# EAGLE design shrew-rx (EAGLE 7.6.0)
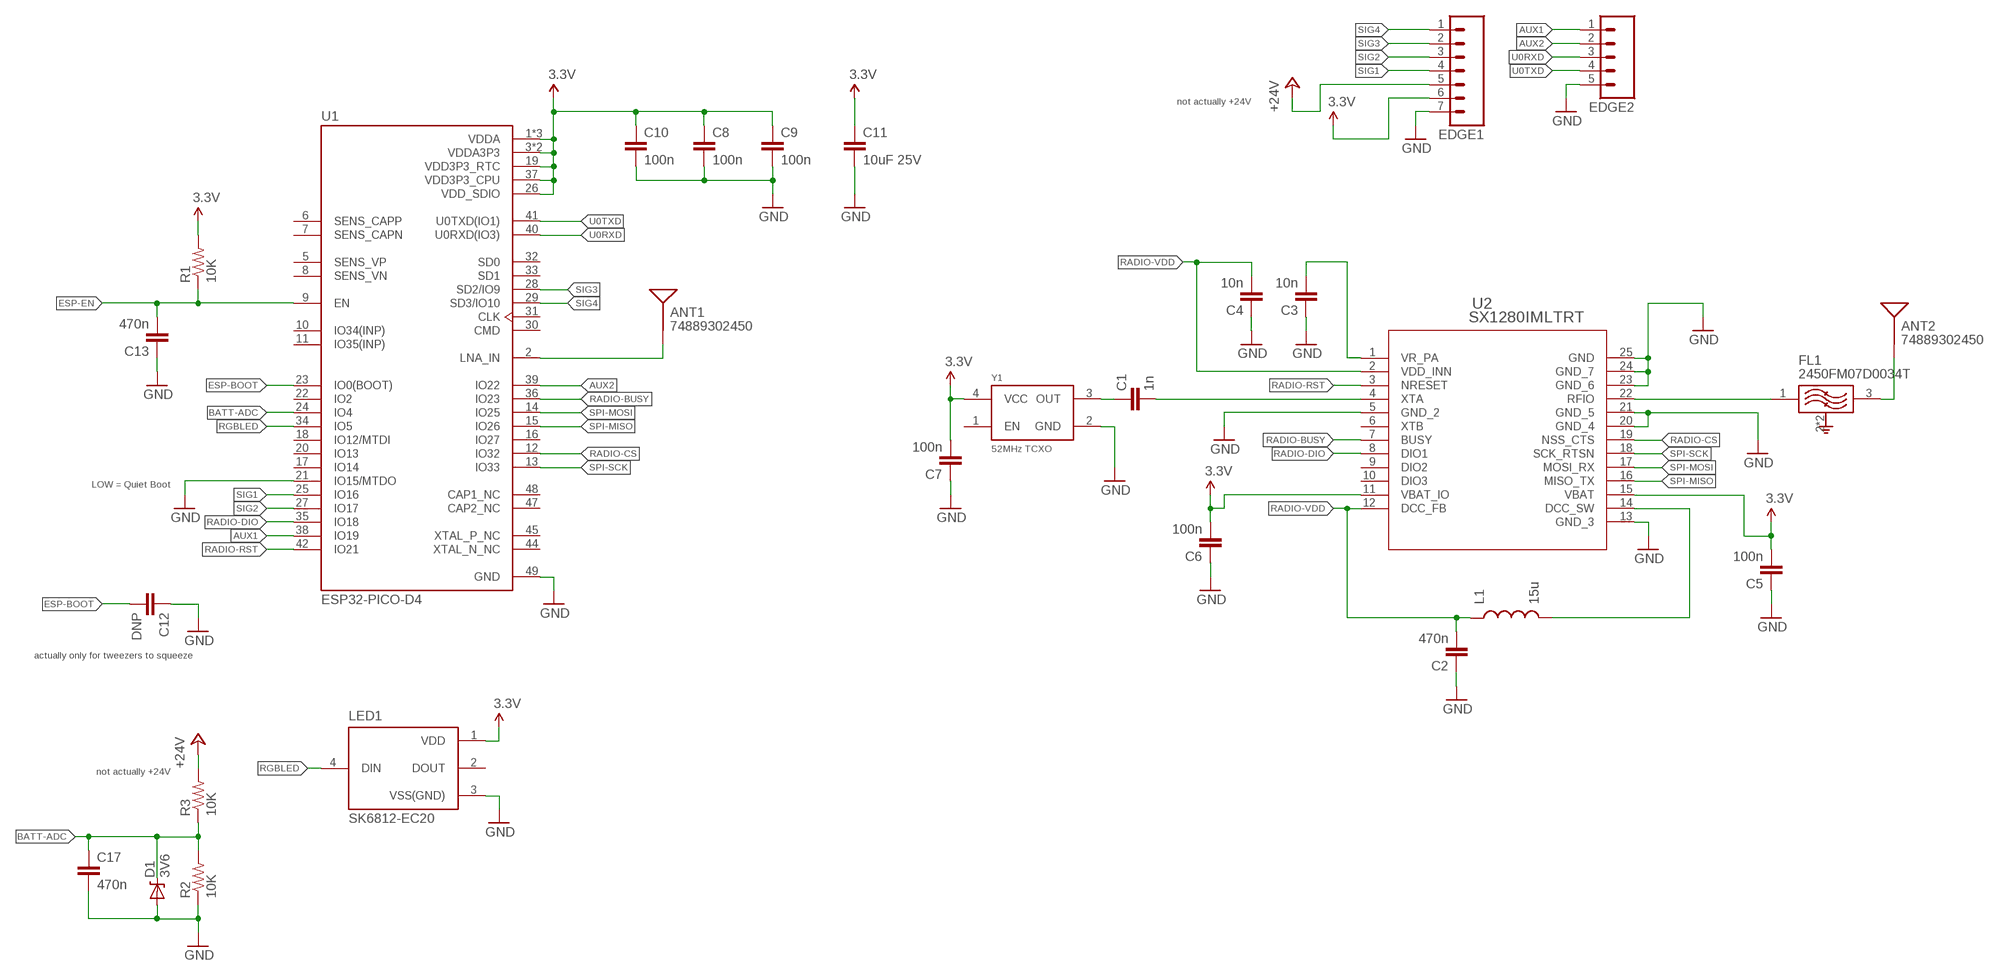
[diagram p0: schematic, sheet 1]

## Parts
ANT1  74889302450  ANTENNA2SMD  [ANTENNA-CHIP2]
ANT2  74889302450  ANTENNA2SMD  [ANTENNA-CHIP2]
C1  1n  CAP0402-REV  [0402-REV]
C2  470n  CAP0402-REV  [0402-REV]
C3  10n  CAP0402-REV  [0402-REV]
C4  10n  CAP0402-REV  [0402-REV]
C5  100n  CAP0402-REV  [0402-REV]
C6  100n  CAP0402-REV  [0402-REV]
C7  100n  CAP0402-REV  [0402-REV]
C8  100n  CAP0402-REV  [0402-REV]
C9  100n  CAP0402-REV  [0402-REV]
C10  100n  CAP0402-REV  [0402-REV]
C11  10uF 25V  CAP0805  [0805]
C12  DNP  CAP0402-CAP  [0402-CAP]
C13  470n  CAP0402-REV  [0402-REV]
C17  470n  CAP0402-REV  [0402-REV]
D1  3V6  DIODE-ZENER-BZT52  [SOD-323]
EDGE1  M07-2MM-TH  [1X07-2MM-TH]
EDGE2  M05PTH  [1X05]
FL1  2450FM07D0034T  [FIL_2450FM07D0034T]
L1  15u  INDUCTOR0805  [0805]
LED1  SK6812-EC20  [SK6812-EC20]
R1  10K  RESISTOR0402-REV  [0402-REV]
R2  10K  RESISTOR0402-REV  [0402-REV]
R3  10K  RESISTOR0402-REV  [0402-REV]
U1  ESP32-PICO-D4  [PQFN50P700X700X104-49N]
U2  SX1280IMLTRT  [QFN24_4X4_SEM]
Y1  52MHz TCXO  OSCILLATOR-TG2016SMN  [OSC_TG2016SMN_50.0000M-ECGNNMB]

## Nets
3.3V: C5.2 C6.2 C7.2 C8.1 C9.1 C10.1 C11.1 EDGE1.6 LED1.1(VDD) R1.2 U1.1(VDDA) U1.3(VDDA3P3) U1.4(VDDA3P3) U1.19(VDD3P3_RTC) U1.26(VDD_SDIO) U1.37(VDD3P3_CPU) U1.43(VDDA) U1.46(VDDA) U2.11(VBAT_IO) U2.15(VBAT) Y1.4(VCC)
AUX1: EDGE2.1 U1.38(IO19)
AUX2: EDGE2.2 U1.39(IO22)
BATT-ADC: C17.1 D1.1(C) R2.2 R3.1 U1.24(IO4)
ESP-BOOT: C12.2 U1.23(IO0(BOOT))
ESP-EN: C13.2 R1.1 U1.9(EN)
GND: C2.1 C3.1 C4.1 C5.1 C6.1 C7.1 C8.2 C9.2 C10.2 C11.2 C12.1 C13.1 C17.2 D1.2(A) EDGE1.7 EDGE2.5 LED1.3(VSS(GND)) R2.1 U1.21(IO15/MTDO) U1.49(GND) U2.5(GND_2) U2.13(GND_3) U2.20(GND_4) U2.21(GND_5) U2.23(GND_6) U2.24(GND_7) U2.25(GND) Y1.2(GND)
N$1: ANT1.FEED(SIGNAL) U1.2(LNA_IN)
N$2: C1.1 Y1.3(OUT)
N$3: C1.2 U2.4(XTA)
N$6: FL1.1(IN) U2.22(RFIO)
N$7: ANT2.FEED(SIGNAL) FL1.3(OUT)
N$9: L1.2 U2.14(DCC_SW)
N$11: C3.2 U2.1(VR_PA)
RADIO-BUSY: U1.36(IO23) U2.7(BUSY)
RADIO-CS: U1.12(IO32) U2.19(NSS_CTS)
RADIO-DIO: U1.35(IO18) U2.8(DIO1)
RADIO-RST: U1.42(IO21) U2.3(NRESET)
RADIO-VDD: C2.2 C4.2 L1.1 U2.2(VDD_INN) U2.12(DCC_FB)
RGBLED: LED1.4(DIN) U1.34(IO5)
SIG1: EDGE1.4 U1.25(IO16)
SIG2: EDGE1.3 U1.27(IO17)
SIG3: EDGE1.2 U1.28(SD2/IO9)
SIG4: EDGE1.1 U1.29(SD3/IO10)
SPI-MISO: U1.15(IO26) U2.16(MISO_TX)
SPI-MOSI: U1.14(IO25) U2.17(MOSI_RX)
SPI-SCK: U1.13(IO33) U2.18(SCK_RTSN)
U0RXD: EDGE2.3 U1.40(U0RXD(IO3))
U0TXD: EDGE2.4 U1.41(U0TXD(IO1))
V-ADC: EDGE1.5 R3.2 ; supply symbol labelled +24V
Unconnected: LED1.2(DOUT) U1.5(SENS_VP) U1.6(SENS_CAPP) U1.7(SENS_CAPN) U1.8(SENS_VN) U1.10(IO34(INP)) U1.11(IO35(INP)) U1.16(IO27) U1.17(IO14) U1.18(IO12/MTDI) U1.20(IO13) U1.22(IO2) U1.30(CMD) U1.31(CLK) U1.32(SD0) U1.33(SD1) U1.44(XTAL_N_NC) U1.45(XTAL_P_NC) U1.47(CAP2_NC) U1.48(CAP1_NC) U2.6(XTB) U2.9(DIO2) U2.10(DIO3) Y1.1(EN)

## Notes on the sheet
- not actually +24V
- LOW = Quiet Boot
- actually only for tweezers to squeeze
- not actually +24V

## Power pins joined to a net without a drawn wire
GND: FL1.2(GND) FL1.4(GND)

## Library data of the parts
ANT1 ANT2 = shrew-common:ANTENNA2: Antenna Single endded antenna. Common with smaller chip antennas. CHIP4 package is the GPS Chip Antenna SKU: GPS-08418. CHIP5 package is 2.4GHz chip antenna SKU: WRL-00144.
C1-C13 C17 = shrew-common:CAP: Capacitor Standard 0603 ceramic capacitor, and 0.1" leaded capacitor.
D1 = shrew-common:DIODE-ZENER: Zener Diode Production Part - 8199 3.4V Zener Voltage
EDGE1 = shrew-common:M07: Header 7 Standard 7-pin 0.1" header. Use with straight break away headers (SKU : PRT-00116), right angle break away headers (PRT-00553), swiss pins (PRT-00743), machine pins (PRT-00117), and female headers (PRT-00115). NOTES ON THE VARIANTS LOCK and LOCK_LONGPADS... This footprint was designed to help hold the alignment of a through-hole component (i.e. 7-pin header) while soldering it into place. You may notice that each hole has been shifted either up or down by 0.005 of an inch from it's more standard position (which is usually a perfectly straight line). This slight alteration caused the pins (the squares in the middle) to touch the edges of the holes. Because they are alternating, it causes a "brace" to hold the header in place. 0.005 has proven to be the perfect amount of "off-center" position when using our standard breakaway headers. Although looks a little odd when you look at the bare footprint, once you have a header in there, the alteration is very hard to notice. Also, if you push a header all the way into place, it is covered up entirely on the bottom side. This idea of altering the position of holes to aid alignment will be further integrated into the Sparkfun Library for other footprints. It can help hold any component with 3 or more connection pins.
EDGE2 = shrew-common:M05: Header 5 Standard 5-pin 0.1" header. Use with straight break away headers (SKU : PRT-00116), right angle break away headers (PRT-00553), swiss pins (PRT-00743), machine pins (PRT-00117), and female headers (PRT-00115). Molex polarized connector foot print use with SKU : PRT-08230 with associated crimp pins and housings.
FL1 = shrew-core:2450FM07D0034T: 2.4GHz ~ 2.5GHz Frequency RF Filter (Radio Frequency) 100MHz Bandwidth 0.75dB 0402 (1005 Metric), 4 PC Pad Check availability <https://pricing.snapeda.com/parts/2450FM07D0034T/Johanson%20Technology%20Inc./view-part?ref=eda>; AVAILABILITY: In Stock; CHECK_PRICES: https://www.snapeda.com/parts/2450FM07D0034T/Johanson+Technology+Inc./view-part/?ref=eda; DESCRIPTION: 2.4GHz ~ 2.5GHz Frequency - RF Filter (Radio Frequency) 100MHz Bandwidth 0.75dB 0402 (1005 Metric), 4 PC Pad; MF: Johanson Technology Inc.; MP: 2450FM07D0034T; PACKAGE: 0402 Johanson Technology Inc.; PRICE: None; SNAPEDA_LINK: https://www.snapeda.com/parts/2450FM07D0034T/Johanson+Technology+Inc./view-part/?ref=snap
L1 = shrew-common:INDUCTOR: Inductors Basic Inductor/Choke - 0603 and 1206. Footprints are not proven and vary greatly between part numbers.
LED1 = shrew-core:SK6812: SMD 5050 Full color RGB LED data transmission frequency up to 800Kbps, with 30 fps refresh rate, 5.00x5.00 mm Check availability <https://pricing.snapeda.com/parts/SK6812/Shenzhen%20LED%20Color%20Optoelectronic%20Inc./view-part?ref=eda>
R1-R3 = shrew-common:RESISTOR: Resistor Basic schematic elements and footprints for 0603, 1206, and PTH resistors.
U1 = shrew-core:ESP32-PICO-D4: Bluetooth, WiFi 802.11b/g/n, Bluetooth v4.2 +EDR, Class 1, 2 and 3 Transceiver Module 2.4GHz ~ 2.5GHz Surface Mount Check availability <https://pricing.snapeda.com/parts/ESP32-PICO-D4/Espressif%20Systems/view-part?ref=eda>; AVAILABILITY: In Stock; CHECK_PRICES: https://www.snapeda.com/parts/ESP32-PICO-D4/Espressif+Systems/view-part/?ref=eda; DESCRIPTION: Bluetooth, WiFi 802.11b/g/n, Bluetooth v4.2 +EDR, Class 1, 2 and 3 Transceiver Module 2.4GHz ~ 2.5GHz - Surface Mount; MF: Espressif Systems; MP: ESP32-PICO-D4; PACKAGE: SMD-48 Espressif Systems; PRICE: None; SNAPEDA_LINK: https://www.snapeda.com/parts/ESP32-PICO-D4/Espressif+Systems/view-part/?ref=snap
U2 = shrew-core:SX1280IMLTRT; COPYRIGHT: Copyright (C) 2024 Ultra Librarian. All rights reserved.; MANUFACTURER_PART_NUMBER: SX1280IMLTRT; MFR_NAME: Semtech
Y1 = shrew-common:OSCILLATOR

## Board
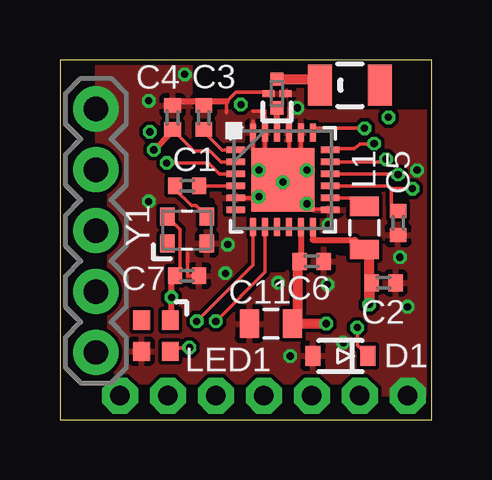
[diagram p1: board, top side]
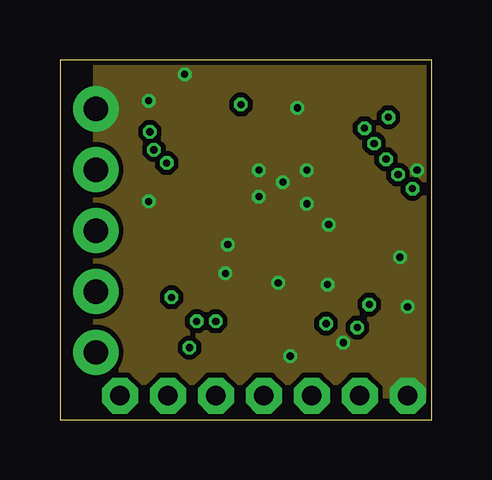
[diagram p2: board, inner layer Route2]
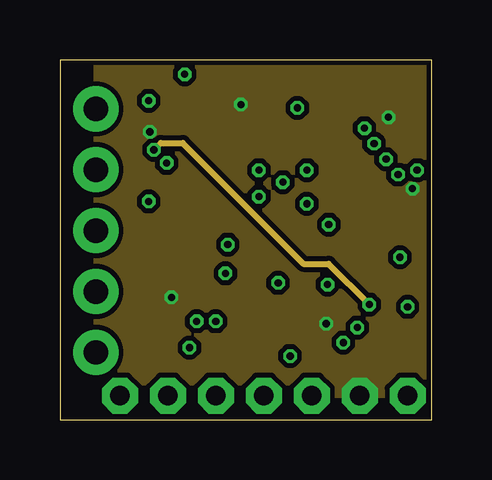
[diagram p3: board, inner layer Route15]
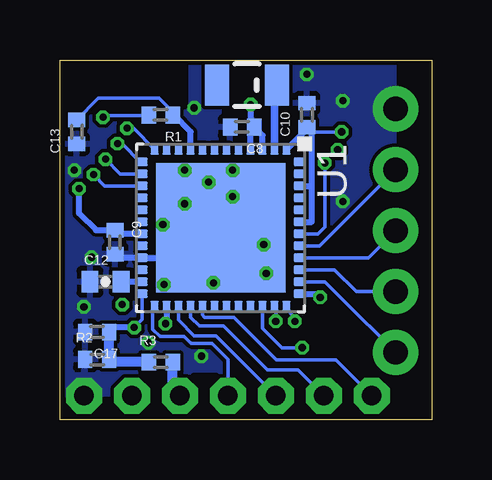
[diagram p4: board, bottom side, seen from below]

Size 15.5 x 15 mm. Coordinates in mm from the lower left corner, seen from the top.
Outline: 0,0 15.5,0 15.5,15 0,15 0,0
Copper layers (1+2*15+16): Top 0.035mm / dielectric 0.2mm / Route2 0.0175mm / dielectric 1.065mm / Route15 0.0175mm / dielectric 0.2mm / Bottom 0.035mm
Design rules "jlcpcb-4layers": minimum track width 3.5mil, minimum drill 0.2mm, track to track 5mil, track to pad 5mil, pad to pad 5mil, via to via 5mil, smd to smd 5mil, copper to edge 0.2mm, drill to drill 6mil, minimum pad ring 10mil, minimum via ring 0.13mm, stop-mask expansion 0.05mm, vias tented up to drill 16mil, thermal gap 8mil
tRestrict: area 11.1,13.1 to 12.9,14.8; area 5.7,13.1 to 8.6,15; area 12.9,13.1 to 15.3,14.8; 8 lines
bRestrict: area 10.3,13.1 to 13.9,14.8; 6 lines
vRestrict: area 10.3,13.1 to 13.9,14.8; area 5.7,13.4 to 9.5,15; area 13.9,13.1 to 15.3,14.8; 2 lines

### Footprints (pad centres in the part's own frame; a part is rotated, then mirrored left to right if it is on the bottom)
ANTENNA-CHIP2 = smd 1.7 x 1: ? 0,-1.25; FEED 0,1.25
0402-REV = smd 0.6 x 0.7: 1 -0.5,0; 2 0.5,0
0805 = smd 0.8 x 1.2: 1 -0.9,0; 2 0.9,0
0402-CAP = smd 0.7 x 0.9: 1 -0.65,0; 2 0.65,0
SOD-323 = smd 0.63 x 0.83: 1 -1.15,0; 2 1.15,0
1X07-2MM-TH = drill 0.8 pad 1.5 octagon: 1 -6,0; 2 -4,0; 3 -2,0; 4 0,0; 5 2,0; 6 4,0; 7 6,0
1X05 = drill 1.016 pad 1.88: 1 0,0; 2 2.54,0; 3 5.08,0; 4 7.62,0; 5 10.16,0
FIL_2450FM07D0034T = smd 0.55 x 0.55: 1 -0.6,0; 3 0.6,0 | smd 0.3 x 0.5: 2 0,-0.35; 4 0,0.35
SK6812-EC20 = smd 0.8 x 0.7: 1 0.65,-0.6; 2 0.65,0.6; 3 -0.65,0.6; 4 -0.65,-0.6
PQFN50P700X700X104-49N = smd 0.45 x 0.35: 1 -3.265,2.75; 2 -3.265,2.25; 3 -3.265,1.75; 4 -3.265,1.25; 5 -3.265,0.75; 6 -3.265,0.25; 7 -3.265,-0.25; 8 -3.265,-0.75; 9 -3.265,-1.25; 10 -3.265,-1.75; 11 -3.265,-2.25; 12 -3.265,-2.75; 25 3.265,-2.75; 26 3.265,-2.25; 27 3.265,-1.75; 28 3.265,-1.25; 29 3.265,-0.75; 30 3.265,-0.25; 31 3.265,0.25; 32 3.265,0.75; 33 3.265,1.25; 34 3.265,1.75; 35 3.265,2.25; 36 3.265,2.75 | smd 0.35 x 0.45: 13 -2.75,-3.265; 14 -2.25,-3.265; 15 -1.75,-3.265; 16 -1.25,-3.265; 17 -0.75,-3.265; 18 -0.25,-3.265; 19 0.25,-3.265; 20 0.75,-3.265; 21 1.25,-3.265; 22 1.75,-3.265; 23 2.25,-3.265; 24 2.75,-3.265; 37 2.75,3.265; 38 2.25,3.265; 39 1.75,3.265; 40 1.25,3.265; 41 0.75,3.265; 42 0.25,3.265; 43 -0.25,3.265; 44 -0.75,3.265; 45 -1.25,3.265; 46 -1.75,3.265; 47 -2.25,3.265; 48 -2.75,3.265 | smd 5.4 x 5.4: 49 0,0
QFN24_4X4_SEM = smd 0.762 x 0.254: 1 -1.968,1.25; 2 -1.968,0.75; 3 -1.968,0.25; 4 -1.968,-0.25; 5 -1.968,-0.75; 6 -1.968,-1.25; 13 1.968,-1.25; 14 1.968,-0.75; 15 1.968,-0.25; 16 1.968,0.25; 17 1.968,0.75; 18 1.968,1.25 | smd 0.254 x 0.762: 7 -1.25,-1.968; 8 -0.75,-1.968; 9 -0.25,-1.968; 10 0.25,-1.968; 11 0.75,-1.968; 12 1.25,-1.968; 19 1.25,1.968; 20 0.75,1.968; 21 0.25,1.968; 22 -0.25,1.968; 23 -0.75,1.968; 24 -1.25,1.968 | smd 2.642 x 2.642: 25 0,0
OSC_TG2016SMN_50.0000M-ECGNNMB = smd 0.75 x 0.6: 1 -0.565,0.825; 2 -0.565,-0.825; 3 0.565,-0.825; 4 0.565,0.825

### Placement (x,y rotation side)
ANT1  7.7,13.95 270 bottom
ANT2  12.1,13.95 90 top
C1  5.3,9.75 0 top
C2  13.5,5.7 180 top
C3  6,12.6 270 top
C4  4.7,12.6 270 top
C5  14.1,8.2 90 top
C6  10.5,6.6 180 top
C7  5.3,6 180 top
C8  7.9,12.2 180 bottom
C9  13.2,7.4 270 bottom
C10  5.2,12.7 90 bottom
C11  8.8,4 180 top
C12  13.6,5.75 0 bottom
C13  14.8,12 90 bottom
C17  13.95,3.65 180 bottom
D1  11.7,2.65 180 top
EDGE1  8.5,1 0 top
EDGE2  1.5,2.8 90 top
FL1  9.05,13.6 90 top
L1  12.7,8 90 top
LED1  4,3.5 90 top
R1  11.3,12.7 180 bottom
R2  13.95,2.51 0 bottom
R3  11.3,2.4 0 bottom
U1  8.8,8 270 bottom
U2  9.3,10 0 top
Y1  5.3,7.9 90 top

### Tracks (layer width: path | path; a pad name or v marks a point on that pad's centre or on a via)
3.3V  (via drill 0.3)
  Top 0.152: Y1.4 5.02,7.92 5.02,6 C7.2 | U2.15 13.7,9.75 13.82,9.63 | v14.7,9.63 13.82,9.63 | C5.2 13.82,8.98 13.82,9.63
  Top 0.254: U2.11 10.05,6.9 C6.2 | 4.47,8.5 Y1.4 | LED1.1 4.65,4.2 v4.65,5.1 4.65,6 C7.2
  Top 0.406: v11.1,4 9.85,4 9.85,4.15 C11.1 9.91,4 9.91,6.51 C6.2
  Bottom 0.152: v3.75,12 5,12 5.06,12 | v13.7,12.61 13.64,12.67 11.8,12.67 R1.2
  Bottom 0.254: U1.3 7.05,11.85 C8.1 | U1.4 7.55,11.9 C8.1 | v7.55,13.14 7.55,12.6 C8.1 | U1.1 5.27,12.05 C10.1 5,12.05 5,12 5,9.75 | U1.46 5,9.75 | U1.43 5,8.25 5,9.75 | U1.37 4.65,5.25 v4.65,5.1 | v14.7,9.63 14.7,8.6 14,7.9 C9.1 13.2,7.75 U1.19 | U1.26 11.05,4.05 v11.1,4
  pour Route15 (isolate 0.203, no thermals): 1.5,1 1.5,15 15.5,15 15.5,1
AUX1
  Bottom 0.152: U1.38 4.45,5.75 3.8,5.1 EDGE2.1
AUX2
  Bottom 0.152: U1.39 4.05,6.25 3.14,5.34 EDGE2.2
BATT-ADC  (via drill 0.3)
  Top 0.152: D1.1 12.4,3.1 v12.4,3.84
  Bottom 0.152: v12.4,3.84 12.06,4.17 U1.24
  Bottom 0.254: v12.4,3.84 13.45,3.84 C17.1
  Bottom 0.406: C17.1 R2.2 13.2,2.4 R3.1
ESP-BOOT
  Bottom 0.152: C12.2 12.9,5.75
  Bottom 0.254: U1.23 12.9,5.75
ESP-EN
  Bottom 0.152: C13.2 13.9,13.4 11.36,13.4 10.8,12.84 R1.1
  Bottom 0.254: U1.9 10.05,12 10.75,12.7 R1.1
GND  (via drill 0.3)
  Top 0.152: v9.9,13 9.55,13 U2.21 | 5.33,6.93 5.33,6 5.69,6 | U2.5 9.3,9.25 U2.25 | 11.14,8.78 9.3,8.78 U2.25 | 10.05,11.79 10.05,10 U2.25 | U2.21 9.55,10 U2.25 | U2.25 8.55,10 U2.23 8.55,12.87 8.05,12.87 | 8.05,12.45 8.05,10 U2.25 | 8.74,13.66 7.34,13.66 6.95,13.27 6.95,12.8 | U2.21 9.55,10.4 v10.3,10.4
  Top 0.254: 6.95,13.27 6,13.27 | 6,13.27 4.77,13.27 | C3.1 6,13.27
  Bottom 0.152: U1.49 9.3,8.5 v9.3,9.9
  Bottom 0.254: C9.2 13.1,6.75 U1.21 11.16,6.75 v11.16,5.63
  other vias: 11.21,8.13 14.18,6.77 8.3,10.4 8.3,9.3 10.3,9 7,7.3 6.9,6.1 3.7,9.1 3.7,13.3 5.2,14.4 14.9,10.4 14.5,4.7 9.1,5.7 9.6,2.65 11.82,3.21
  pour Top (isolate 0.152, rank 5): 1.5,1 1.5,15 15.5,15 15.5,1
  pour Bottom (isolate 0.152, rank 5): 1.5,1 1.5,15 15.5,15 15.5,1
  pour Top (isolate 0.152, no thermals): 13.1,1 13.1,2.2 15.5,2.2 15.5,1
  pour Route2 (isolate 0.203, no thermals): 1.5,1 1.5,15 15.5,15 15.5,1
  pour Top (isolate 0.152, no thermals): 1.5,15 1.5,10.5 2.8,10.5 2.8,15
  pour Bottom (isolate 0.152, no thermals): 1.5,15 2.8,15 2.8,12.3 2.8,10.5 1.5,10.5
  pour Bottom (isolate 0.152, no thermals): 15.5,0.9 15.5,1.9 13.1,1.9 13.1,0.9
N$1
  Bottom 0.305: U1.2 6.55,13.95 ANT1.FEED
N$2
  Top 0.152: Y1.3 5.67,8.92 5.48,8.92 4.8,9.6 C1.1
N$3
  Top 0.152: C1.2 U2.4
N$6
  Top 0.25: U2.22 FL1.1
N$7
  Top 0.406: FL1.3 10.85,14.2 ANT2.FEED
N$9
  Top 0.152: U2.14 12.3,9.25 L1.2
N$11
  Top 0.152: U2.1 6.75,11.25 6.05,11.95 C3.2
RADIO-BUSY  (via drill 0.3)
  Top 0.152: U2.7 8.05,6.45 v5.7,4.1
  Bottom 0.152: v5.7,4.1 5.82,4.22 5.73,4.29 6.05,4.61 U1.36
RADIO-CS  (via drill 0.3)
  Top 0.152: v12.7,12.15 10.55,12.15 U2.19
  Bottom 0.152: U1.12 12.44,12.15 v12.7,12.15
RADIO-DIO  (via drill 0.3)
  Top 0.152: U2.8 8.55,6.15 v6.5,4.1
  Bottom 0.152: U1.35 6.5,4.73 v6.5,4.1
RADIO-RST  (via drill 0.3)
  Top 0.152: U2.3 6.65,10.25 6.2,10.7 v4.45,10.7
  Bottom 0.152: U1.42 4.74,7.75 4.45,8.04 v4.45,10.7
RADIO-VDD  (via drill 0.3)
  Top 0.152: U2.2 6.71,10.75 6.26,11.2 5.6,11.2 C4.2 4.7,11.97 4.64,11.97
  Top 0.254: 12.5,7.1 L1.1 12.3,7.5 10.55,7.5 U2.12 | v3.92,11.25 4.64,11.97
  Top 0.406: L1.1 12.9,7.1 v12.9,4.8 12.9,5.7 C2.2
  Route15 0.254: v3.92,11.25 4.2,11.53 5.12,11.53 10.15,6.5 11.2,6.5 v12.9,4.8
RGBLED  (via drill 0.3)
  Top 0.152: LED1.4 4.75,3 v5.4,3
  Bottom 0.152: v5.4,3 6.25,3 7.05,3.8 U1.34
SIG1
  Bottom 0.152: U1.25 11.63,4.73 11.63,3.77 11.33,3.47 10.32,3.47 10.03,3.18 9.16,3.18 8.5,2.52 EDGE1.4
SIG2
  Bottom 0.152: EDGE1.3 9,3.5 9.9,3.5 10.55,4.15 U1.27
SIG3
  Bottom 0.152: EDGE1.2 5.57,2.07 6.85,2.07 8.68,3.9 9.68,3.9 10.05,4.27 U1.28
SIG4
  Bottom 0.152: EDGE1.1 3.98,2.48 6.46,2.48 8.25,4.27 9.46,4.27 9.55,4.36 U1.29
SPI-MISO  (via drill 0.3)
  Top 0.152: U2.16 14.07,10.25 v14.1,10.22
  Bottom 0.152: U1.15 13.63,9.75 v14.1,10.22
SPI-MOSI  (via drill 0.3)
  Top 0.152: U2.17 13.49,10.75 v13.6,10.86
  Bottom 0.152: U1.14 12.99,10.25 v13.6,10.86
SPI-SCK  (via drill 0.3)
  Top 0.152: U2.18 11.55,11.25 11.6,11.3 12.29,11.3 12.5,11.5 v13.09,11.5 arc90 v13.1,11.51
  Bottom 0.152: U1.13 12.15,10.75 12.91,11.51 v13.1,11.51
U0RXD
  Bottom 0.152: U1.40 2.63,6.75 EDGE2.3
U0TXD
  Bottom 0.152: U1.41 4.67,7.25 3.6,8.32 EDGE2.4
V-ADC
  Bottom 0.406: EDGE1.5 10.8,1 R3.2